# EAGLE design ch559 (EAGLE 9.6.2)
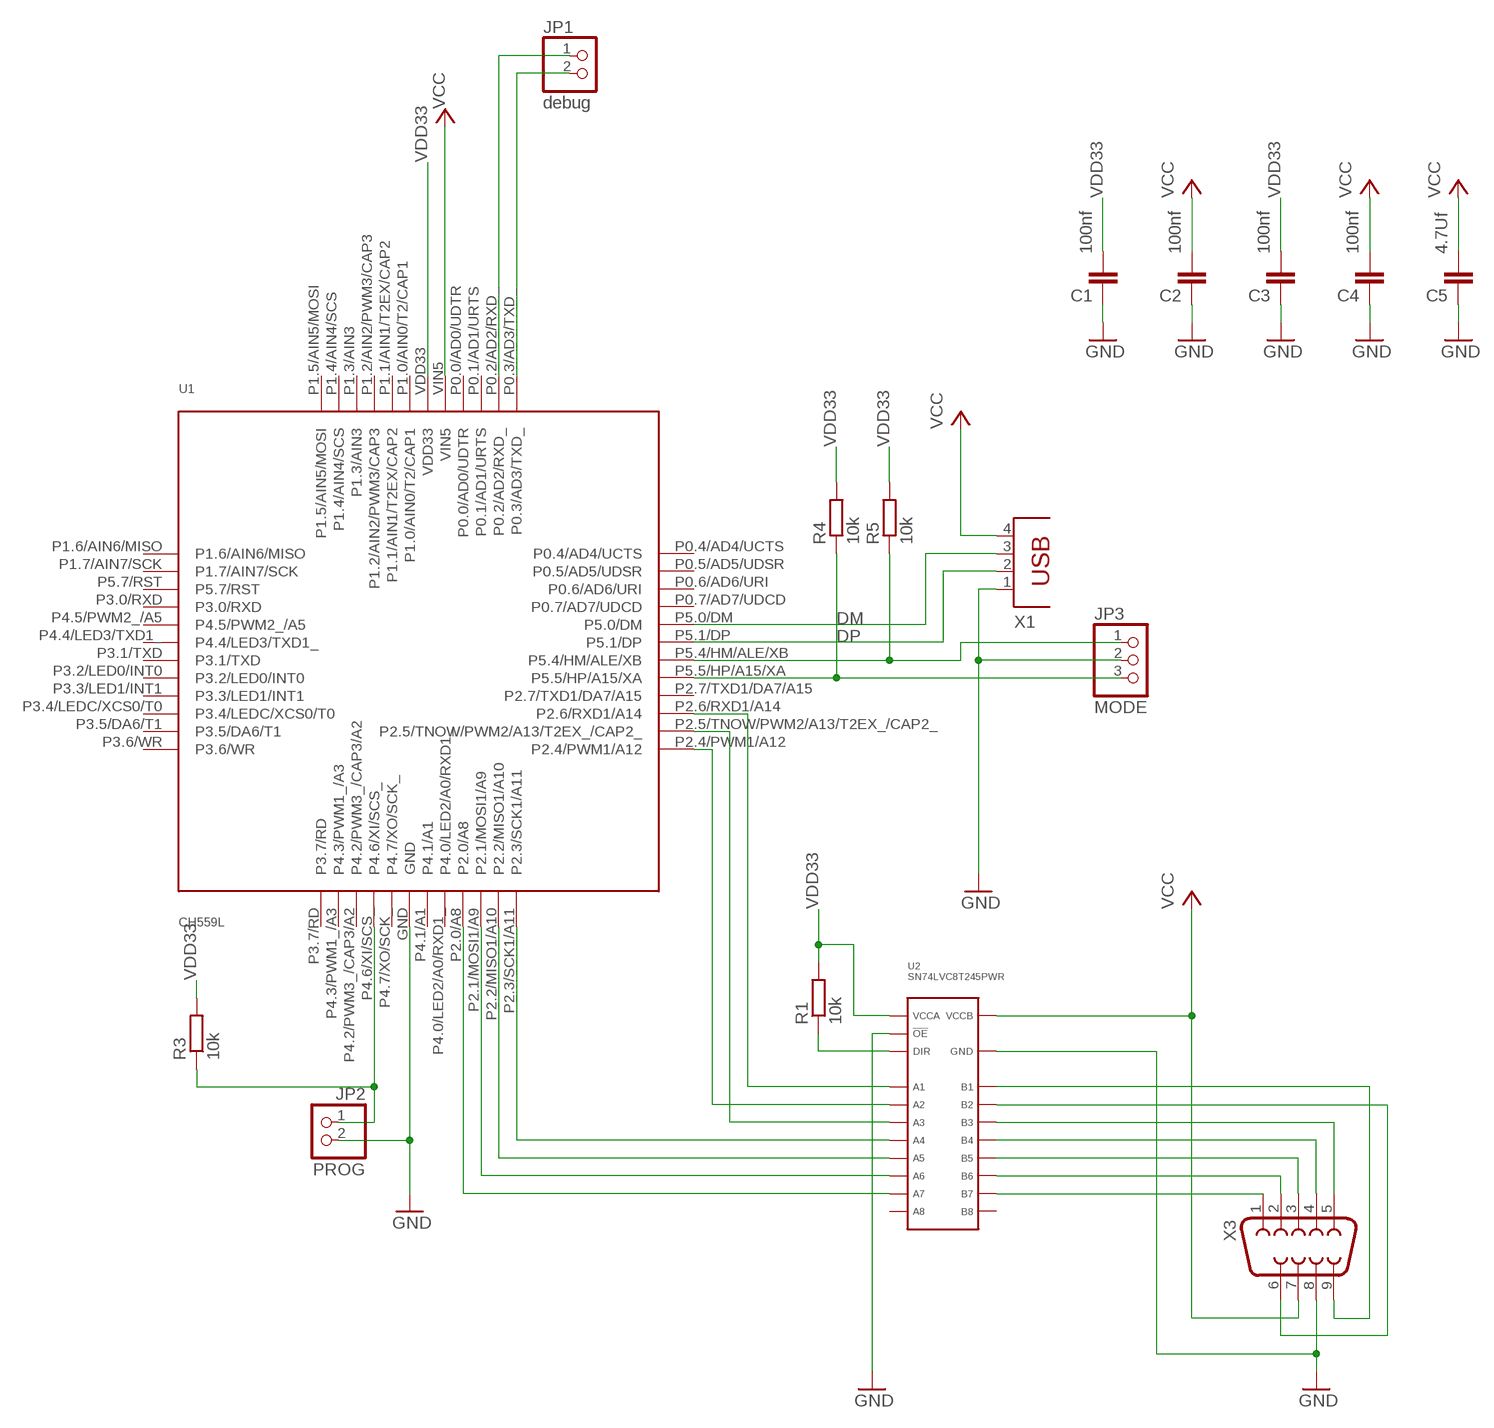
[diagram p0: schematic, sheet 1]

## Parts
C1  100nf  C-EUC0603  [C0603]
C2  100nf  C-EUC0603  [C0603]
C3  100nf  C-EUC0603  [C0603]
C4  100nf  C-EUC0603  [C0603]
C5  4.7Uf  C-EUC0603  [C0603]
JP1  debug  PINHD-1X2  [1X02]
JP2  PROG  PINHD-1X2  [1X02]
JP3  MODE  PINHD-1X3  [1X03]
R1  10k  R-EU_R0603  [R0603]
R3  10k  R-EU_R0603  [R0603]
R4  10k  R-EU_R0603  [R0603]
R5  10k  R-EU_R0603  [R0603]
U1  CH559L  [TQFP48_7X7]
U2  SN74LVC8T245PWR  [TTSOP-24]
X1  PN87520  [PN87520]
X3  F09D  [F09D]

## Nets
DM: U1.P5.0/DM X1.3
DP: U1.P5.1/DP X1.2
GND: C1.1 C2.1 C3.1 C4.1 C5.1 JP2.2 JP3.2 U1.GND U2.P$11(GND) U2.P$12(GND) U2.P$13(GND) U2.P$22(!OE) X1.1 X3.8
LB: U2.P$17(B5) X3.3
N$1: U2.P$15(B7) X3.1
N$2: U2.P$20(B2) X3.6
N$3: U2.P$21(B1) X3.9
N$5: JP3.1 R5.1 U1.P5.4/HM/ALE/XB
N$6: JP3.3 R4.1 U1.P5.5/HP/A15/XA
N$10: R1.1 U2.P$2(DIR)
P2.0: U1.P2.0/A8 U2.P$9(A7)
P2.1: U1.P2.1/MOSI1/A9 U2.P$8(A6)
P2.2: U1.P2.2/MISO1/A10 U2.P$7(A5)
P2.3: U1.P2.3/SCK1/A11 U2.P$6(A4)
P2.4: U1.P2.4/PWM1/A12 U2.P$4(A2)
P2.5: U1.P2.5/TNOW/PWM2/A13/T2EX_/CAP2_ U2.P$5(A3)
P2.6: U1.P2.6/RXD1/A14 U2.P$3(A1)
PROG: JP2.1 R3.1 U1.P4.6/XI/SCS_
RB: U2.P$16(B6) X3.2
RXD: JP1.1 U1.P0.2/AD2/RXD_
TXD: JP1.2 U1.P0.3/AD3/TXD_
VCC: C2.2 C4.2 C5.2 U1.VIN5 U2.P$23(VCCB) U2.P$24(VCCB) X1.4 X3.7
VDD33: C1.2 C3.2 R1.2 R3.2 R4.2 R5.2 U1.VDD33 U2.P$1(VCCA)
Y1: U2.P$19(B3) X3.5
Y2: U2.P$18(B4) X3.4
Unconnected: U1.P0.0/AD0/UDTR U1.P0.1/AD1/URTS U1.P0.4/AD4/UCTS U1.P0.5/AD5/UDSR U1.P0.6/AD6/URI U1.P0.7/AD7/UDCD U1.P1.0/AIN0/T2/CAP1 U1.P1.1/AIN1/T2EX/CAP2 U1.P1.2/AIN2/PWM3/CAP3 U1.P1.3/AIN3 U1.P1.4/AIN4/SCS U1.P1.5/AIN5/MOSI U1.P1.6/AIN6/MISO U1.P1.7/AIN7/SCK U1.P2.7/TXD1/DA7/A15 U1.P3.0/RXD U1.P3.1/TXD U1.P3.2/LED0/INT0 U1.P3.3/LED1/INT1 U1.P3.4/LEDC/XCS0/T0 U1.P3.5/DA6/T1 U1.P3.6/WR U1.P3.7/RD U1.P4.0/LED2/A0/RXD1_ U1.P4.1/A1 U1.P4.2/PWM3_/CAP3/A2 U1.P4.3/PWM1_/A3 U1.P4.4/LED3/TXD1_ U1.P4.5/PWM2_/A5 U1.P4.7/XO/SCK_ U1.P5.7/RST U2.P$10(A8) U2.P$14(B8)

## Library data of the parts
C1-C5 = rcl:C-EU: CAPACITOR, European symbol; SPICEPREFIX: C
JP1 JP2 = pinhead:PINHD-1X2: PIN HEADER
JP3 = pinhead:PINHD-1X3: PIN HEADER
R1 R3-R5 = rcl:R-EU_: RESISTOR, European symbol; SPICEPREFIX: R
U1 = CH559L:CH559L
U2 = SN74LVC8T245:SN74LVC8T245: Check availability <https://pricing.snapeda.com/parts/SN74LVC8T245/Texas%20Instruments/view-part?ref=eda>; AVAILABILITY: Not in stock; CHECK_PRICES: https://www.snapeda.com/parts/SN74LVC8T245/Texas+Instruments/view-part/?ref=eda; DESCRIPTION: Voltage Level Translator 8-CH Bidirectional 24-Pin SOIC T/R; MF: Texas Instruments; MP: SN74LVC8T245; PACKAGE: None; PRICE: None; SNAPEDA_LINK: https://www.snapeda.com/parts/SN74LVC8T245/Texas+Instruments/view-part/?ref=snap
X1 = con-berg:PN87520: BERG USB connector; OC_FARNELL: unknown; OC_NEWARK: unknown
X3 = con-subd:F09: SUB-D; OC_FARNELL: unknown; OC_NEWARK: unknown

## Board
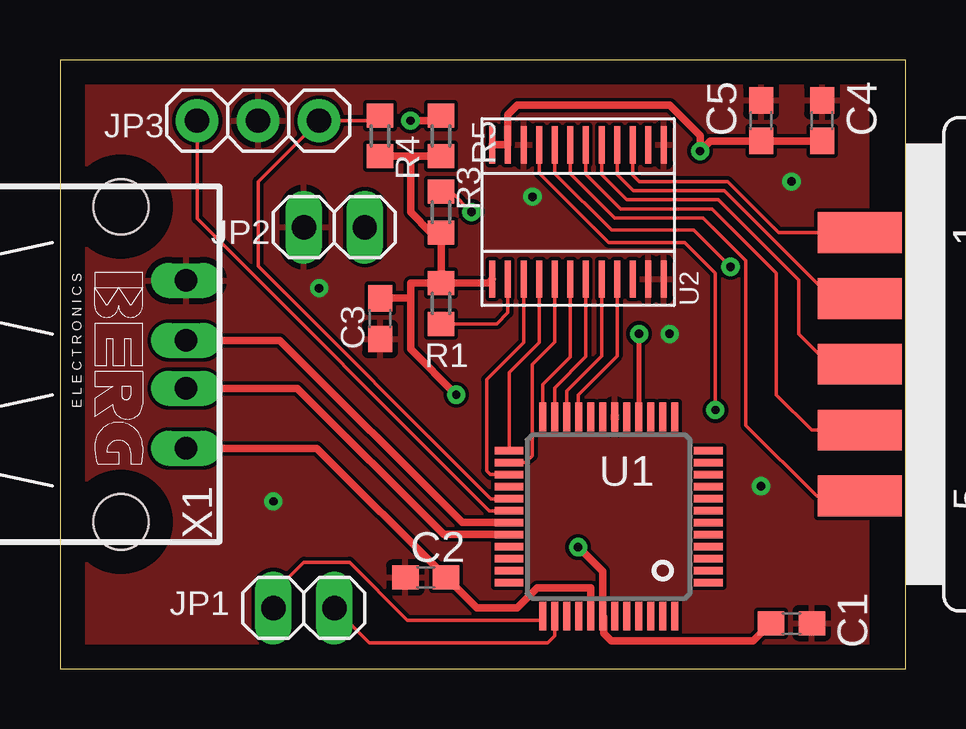
[diagram p1: board, top side]
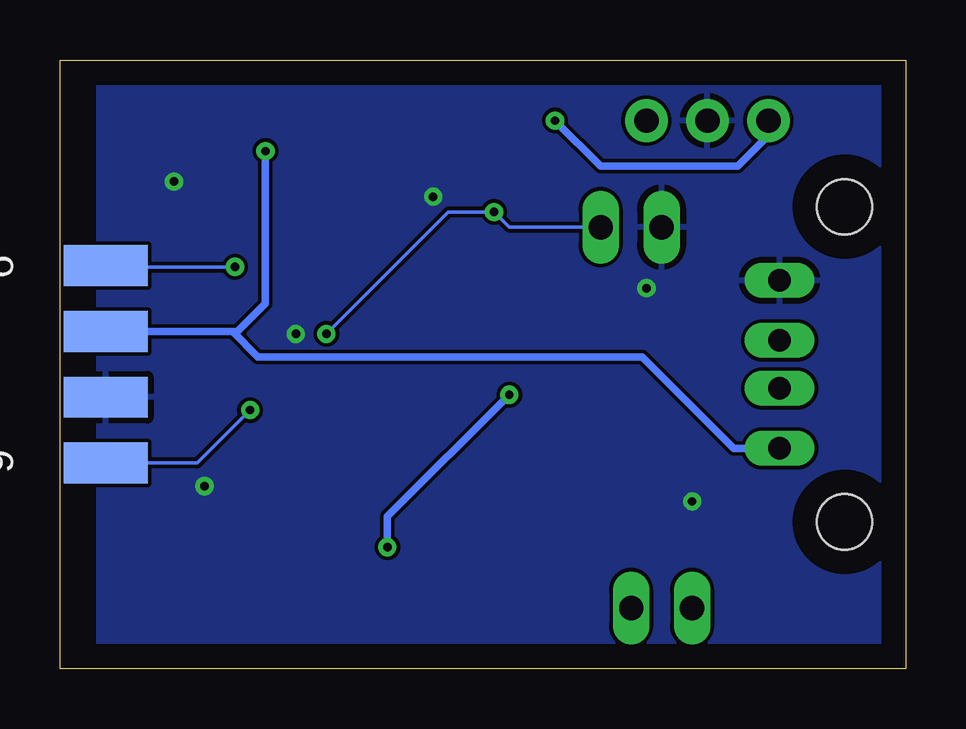
[diagram p2: board, bottom side, seen from below]

Size 35.23 x 25.39 mm. Coordinates in mm from the lower left corner, seen from the top.
Outline: 0,0 35.23,0 35.23,25.39 0,25.39 0,0
Copper layers (1*16): Top 0.035mm / dielectric 1.5mm / Bottom 0.035mm
Design rules "default": minimum track width 6mil, minimum drill 0.35mm, track to track 6mil, track to pad 6mil, pad to pad 6mil, via to via 6mil, smd to smd 6mil, copper to edge 40mil, drill to drill 6mil, minimum pad ring 10mil, minimum via ring 8mil, stop-mask expansion 4mil, vias tented up to drill 0mil, thermal gap 10mil

### Footprints (pad centres in the part's own frame; a part is rotated, then mirrored left to right if it is on the bottom)
C0603 = smd 1.1 x 1: 1 -0.85,0; 2 0.85,0
1X02 = drill 1.016 long: 1 -1.27,0; 2 1.27,0
1X03 = drill 1.016 pad 1.778: 1 -2.54,0; 2 0,0; 3 2.54,0
R0603 = smd 1 x 1.1: 1 -0.85,0; 2 0.85,0
TQFP48_7X7 = smd 0.3 x 1.2: GND -0.25,-4.15; P0.0/AD0/UDTR 1.25,4.15; P0.1/AD1/URTS 1.75,4.15; P0.2/AD2/RXD_ 2.25,4.15; P0.3/AD3/TXD_ 2.75,4.15; P1.0/AIN0/T2/CAP1 -0.25,4.15; P1.1/AIN1/T2EX/CAP2 -0.75,4.15; P1.2/AIN2/PWM3/CAP3 -1.25,4.15; P1.3/AIN3 -1.75,4.15; P1.4/AIN4/SCS -2.25,4.15; P1.5/AIN5/MOSI -2.75,4.15; P2.0/A8 1.25,-4.15; P2.1/MOSI1/A9 1.75,-4.15; P2.2/MISO1/A10 2.25,-4.15; P2.3/SCK1/A11 2.75,-4.15; P3.7/RD -2.75,-4.15; P4.0/LED2/A0/RXD1_ 0.75,-4.15; P4.1/A1 0.25,-4.15; P4.2/PWM3_/CAP3/A2 -1.75,-4.15; P4.3/PWM1_/A3 -2.25,-4.15; P4.6/XI/SCS_ -1.25,-4.15; P4.7/XO/SCK_ -0.75,-4.15; VDD33 0.25,4.15; VIN5 0.75,4.15 | smd 1.2 x 0.3: P0.4/AD4/UCTS 4.15,2.75; P0.5/AD5/UDSR 4.15,2.25; P0.6/AD6/URI 4.15,1.75; P0.7/AD7/UDCD 4.15,1.25; P1.6/AIN6/MISO -4.15,2.75; P1.7/AIN7/SCK -4.15,2.25; P2.4/PWM1/A12 4.15,-2.75; P2.5/TNOW/PWM2/A13/T2EX_/CAP2_ 4.15,-2.25; P2.6/RXD1/A14 4.15,-1.75; P2.7/TXD1/DA7/A15 4.15,-1.25; P3.0/RXD -4.15,1.25; P3.1/TXD -4.15,-0.25; P3.2/LED0/INT0 -4.15,-0.75; P3.3/LED1/INT1 -4.15,-1.25; P3.4/LEDC/XCS0/T0 -4.15,-1.75; P3.5/DA6/T1 -4.15,-2.25; P3.6/WR -4.15,-2.75; P4.4/LED3/TXD1_ -4.15,0.25; P4.5/PWM2_/A5 -4.15,0.75; P5.0/DM 4.15,0.75; P5.1/DP 4.15,0.25; P5.4/HM/ALE/XB 4.15,-0.25; P5.5/HP/A15/XA 4.15,-0.75; P5.7/RST -4.15,1.75
TTSOP-24 = smd 1.55 x 0.25: P$1 -2.8,3.575; P$2 -2.8,2.925; P$3 -2.8,2.275; P$4 -2.8,1.625; P$5 -2.8,0.975; P$6 -2.8,0.325; P$7 -2.8,-0.325; P$8 -2.8,-0.975; P$9 -2.8,-1.625; P$10 -2.8,-2.275; P$11 -2.8,-2.925; P$12 -2.8,-3.575; P$13 2.8,-3.575; P$14 2.8,-2.925; P$15 2.8,-2.275; P$16 2.8,-1.625; P$17 2.8,-0.975; P$18 2.8,-0.325; P$19 2.8,0.325; P$20 2.8,0.975; P$21 2.8,1.625; P$22 2.8,2.275; P$23 2.8,2.925; P$24 2.8,3.575
PN87520 = drill 0.95 long: 1 -3.5,2.71; 2 -1,2.71; 3 1,2.71; 4 3.5,2.71 | hole 2.3: -6.57,0; 6.57,0
F09D = smd 1.7 x 3.5: 1 -5.486,-6.045; 2 -2.743,-6.045; 3 0,-6.045; 4 2.743,-6.045; 5 5.486,-6.045 | smd 1.7 x 3.5 bottom: 6 -4.115,-6.045; 7 -1.372,-6.045; 8 1.372,-6.045; 9 4.115,-6.045

### Placement (x,y rotation side)
C1  30.48,1.91 180 top
C2  15.24,3.81 0 top
C3  13.34,14.61 90 top
C4  31.75,22.86 270 top
C5  29.21,22.86 270 top
JP1  10.16,2.54 180 top
JP2  11.43,18.41 180 top
JP3  8.26,22.86 0 top
R1  15.88,15.24 90 top
R3  15.88,19.05 270 top
R4  13.34,22.23 270 top
R5  15.88,22.23 270 top
U1  22.86,6.35 180 top
U2  21.59,19.05 90 top
X1  2.54,12.7 270 top
X3  39.37,12.7 270 top

### Tracks (layer width: path | path; a pad name or v marks a point on that pad's centre or on a via)
DM
  Top 0.305: X1.3 9.89,11.7 15.99,5.6 U1.P5.0/DM
DP
  Top 0.305: X1.2 9.16,13.7 16.76,6.1 U1.P5.1/DP
GND  (via drill 0.35)
  other vias: 10.79,15.88 19.68,19.68 30.48,20.32 29.21,7.62 8.89,6.99 25.4,13.97
  pour Top: 0,25.4 33.66,25.4 33.66,0 0,0
  pour Bottom: 0,25.4 33.66,25.4 33.66,0 0,0
LB
  Top 0.152: U2.P$17 22.57,20.61 23.62,19.56 27.43,19.56 30.79,16.2 30.79,13.97 32.05,12.7 X3.3
N$1
  Top 0.152: X3.1 29.95,18.19 27.81,20.32 24.13,20.32 23.86,20.59 U2.P$15
N$2  (via drill 0.35)
  Top 0.152: U2.P$20 20.61,20.66 22.99,18.29 26.42,18.29 v27.94,16.76
  Bottom 0.152: X3.6 33.27,16.76 v27.94,16.76
N$3  (via drill 0.35)
  Top 0.152: U2.P$21 19.96,20.68 22.86,17.78 26.04,17.78 27.3,16.51 v27.3,10.79
  Bottom 0.152: v27.3,10.79 29.52,8.59 X3.9
N$5  (via drill 0.35)
  Top 0.152: U1.P5.4/HM/ALE/XB 17.89,6.59 5.71,18.77 JP3.1
  Top 0.305: R5.1 15.66,22.86 v14.61,22.86
  Bottom 0.305: v14.61,22.86 12.7,20.95 6.99,20.95 5.71,22.23 JP3.1
N$6
  Top 0.152: U1.P5.5/HP/A15/XA 17.95,7.09 8.26,16.8 8.26,20.32 JP3.3 13.76,22.86 R4.1
N$10
  Top 0.152: U2.P$2 18.66,14.86 18.2,14.39 R1.1
P2.0
  Top 0.152: U2.P$9 23.21,13.05 21.59,11.43 21.59,10.52 U1.P2.0/A8
P2.1
  Top 0.152: U2.P$8 22.57,13.04 21.11,11.59 U1.P2.1/MOSI1/A9
P2.2
  Top 0.152: U2.P$7 21.91,13.03 20.61,11.72 U1.P2.2/MISO1/A10
P2.3
  Top 0.152: U2.P$6 21.27,13.01 20.11,11.86 U1.P2.3/SCK1/A11
P2.4
  Top 0.152: U2.P$4 19.96,13.62 18.71,12.36 U1.P2.4/PWM1/A12
P2.5
  Top 0.152: U2.P$5 20.61,13.63 19.68,12.7 19.68,8.89 19.39,8.6 U1.P2.5/TNOW/PWM2/A13/T2EX_/CAP2_
P2.6
  Top 0.152: U2.P$3 19.32,13.6 17.78,12.06 17.78,8.26 17.93,8.1 U1.P2.6/RXD1/A14
PROG  (via drill 0.35)
  Top 0.152: R3.1 16.3,19.9 v17.14,19.05
  Top 0.203: U1.P4.6/XI/SCS_ 24.13,10.52 v24.13,13.97
  Bottom 0.152: JP2.1 16.51,18.41 v17.14,19.05 19.05,19.05 v24.13,13.97
RB
  Top 0.152: X3.2 32.18,15.44 27.69,19.94 23.88,19.94 23.21,20.6 U2.P$16
RXD
  Top 0.152: U1.P0.2/AD2/RXD_ 20.61,1.38 20.32,1.09 12.88,1.09 JP1.1
TXD
  Top 0.152: JP1.2 8.89,3.17 10.16,4.45 12.06,4.45 14.48,2.03 20.11,2.03 U1.P0.3/AD3/TXD_
VCC  (via drill 0.35)
  Top 0.305: C4.2 C5.2 27.09,22.01 v26.67,21.59 26.67,22.23 25.4,23.5 19.05,23.5 18.66,23.11 U2.P$23 U2.P$24 | U1.VIN5 22.11,3.38 19.89,3.38 19.05,2.54 17.36,2.54 C2.2 10.7,9.2 X1.4
  Bottom 0.305: X1.4 7.16,9.2 10.96,13.01 26.98,13.01 28.04,14.07 | X3.7 28.04,14.07 | 28.04,14.07 27.84,14.07 26.67,15.24 v26.67,21.59
VDD33  (via drill 0.35)
  Top 0.305: C1.2 28.89,1.17 22.96,1.17 22.66,1.47 22.66,2.15 U1.VDD33 22.61,4.06 v21.59,5.08 | C3.2 14.61,15.46 | R1.2 14.61,16.09 14.61,15.46 | R1.2 17.86,16.09 U2.P$1 | v16.51,11.43 14.61,13.34 14.61,15.46 | R1.2 R3.2 15.46,18.2 14.61,19.05 14.61,21.38 | R4.2 14.61,21.38 | R5.2 14.61,21.38
  Bottom 0.305: v21.59,5.08 21.59,6.35 v16.51,11.43
Y1
  Top 0.152: U2.P$19 21.27,20.64 23.11,18.8 26.8,18.8 28.57,17.02 28.57,10.16 31.52,7.21 X3.5
Y2
  Top 0.152: X3.4 31.32,9.96 29.84,11.43 29.84,16.51 27.18,19.18 23.37,19.18 21.91,20.63 U2.P$18